# EAGLE design board (EAGLE 7.4.0)
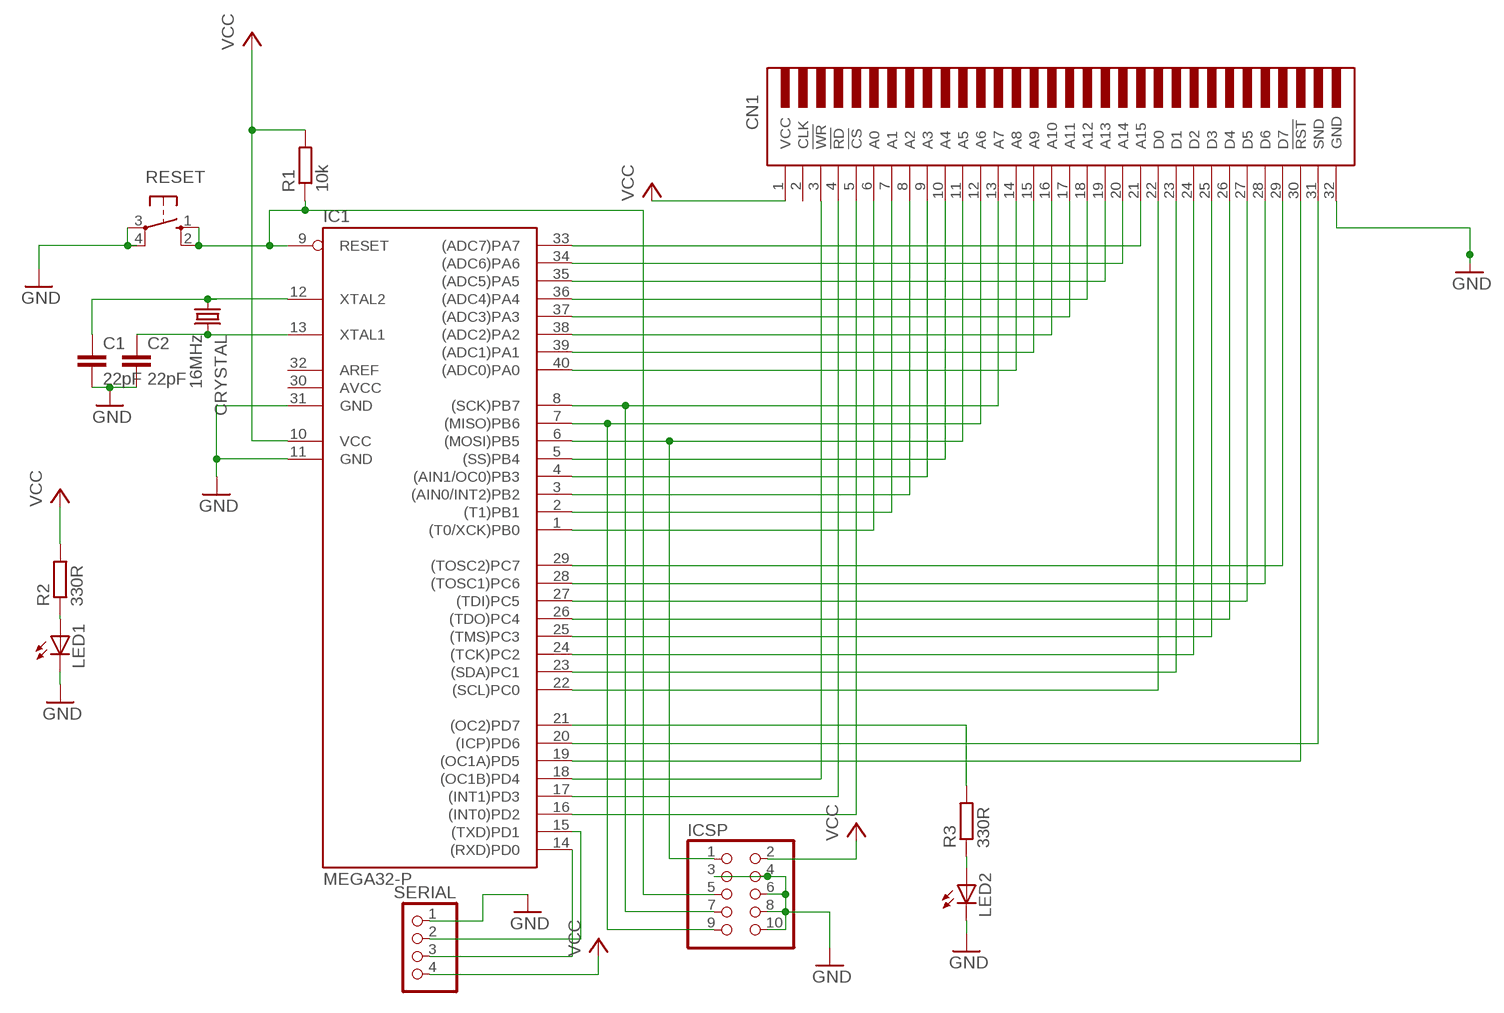
[diagram p0: schematic, sheet 1]

## Parts
C1  22pF  C-EU050-025X075  [C050-025X075]
C2  22pF  C-EU050-025X075  [C050-025X075]
CN1  GBCONN  [GBCONN]
CRYSTAL  16MHz  CRYSTALHC49S  [HC49/S]
IC1  MEGA32-P  [DIL40]
ICSP  PINHD-2X5  [2X05]
LED1  LED3MM  [LED3MM]
LED2  LED3MM  [LED3MM]
R1  10k  R-EU_0204/7  [0204/7]
R2  330R  R-EU_0204/7  [0204/7]
R3  330R  R-EU_0204/7  [0204/7]
RESET  10-XX  [B3F-10XX]
SERIAL  PINHD-1X4/90  [1X04/90]

## Nets
GND: C1.2 C2.2 CN1.32(GND) IC1.11(GND) IC1.31(GND) ICSP.3 ICSP.4 ICSP.6 ICSP.8 ICSP.10 LED1.K(C) LED2.K(C) RESET.3(P) RESET.4(P1) SERIAL.1
N$1: CN1.29(D7) IC1.29((TOSC2)PC7)
N$2: CN1.28(D6) IC1.28((TOSC1)PC6)
N$3: CN1.27(D5) IC1.27((TDI)PC5)
N$4: CN1.26(D4) IC1.26((TDO)PC4)
N$5: CN1.25(D3) IC1.25((TMS)PC3)
N$6: CN1.24(D2) IC1.24((TCK)PC2)
N$7: CN1.23(D1) IC1.23((SDA)PC1)
N$8: CN1.22(D0) IC1.22((SCL)PC0)
N$9: CN1.21(A15) IC1.33((ADC7)PA7)
N$10: CN1.20(A14) IC1.34((ADC6)PA6)
N$11: CN1.19(A13) IC1.35((ADC5)PA5)
N$12: CN1.18(A12) IC1.36((ADC4)PA4)
N$13: CN1.17(A11) IC1.37((ADC3)PA3)
N$14: CN1.16(A10) IC1.38((ADC2)PA2)
N$15: CN1.15(A9) IC1.39((ADC1)PA1)
N$16: CN1.14(A8) IC1.40((ADC0)PA0)
N$17: CN1.13(A7) IC1.8((SCK)PB7) ICSP.7
N$18: CN1.12(A6) IC1.7((MISO)PB6) ICSP.9
N$19: CN1.11(A5) IC1.6((MOSI)PB5) ICSP.1
N$20: CN1.10(A4) IC1.5((SS)PB4)
N$21: CN1.9(A3) IC1.4((AIN1/OC0)PB3)
N$22: CN1.8(A2) IC1.3((AIN0/INT2)PB2)
N$23: CN1.7(A1) IC1.2((T1)PB1)
N$24: CN1.6(A0) IC1.1((T0/XCK)PB0)
N$25: CN1.30(!RST) IC1.19((OC1A)PD5)
N$26: CN1.4(!RD) IC1.17((INT1)PD3)
N$27: CN1.5(!CS) IC1.16((INT0)PD2)
N$28: LED1.A R2.1
N$29: CN1.31(SND) IC1.20((ICP)PD6)
N$30: C1.1 CRYSTAL.1 IC1.12(XTAL2)
N$31: C2.1 CRYSTAL.2 IC1.13(XTAL1)
N$32: CN1.3(!WR) IC1.18((OC1B)PD4)
N$33: LED2.A R3.1
N$34: IC1.21((OC2)PD7) R3.2
N$35: IC1.9(RESET) ICSP.5 R1.1 RESET.1(S) RESET.2(S1)
N$36: IC1.15((TXD)PD1) SERIAL.2
N$37: IC1.14((RXD)PD0) SERIAL.3
VCC: CN1.1(VCC) IC1.10(VCC) ICSP.2 R1.2 R2.2 SERIAL.4
Unconnected: CN1.2(CLK) IC1.32(AREF)

## Power pins joined to a net without a drawn wire
AVCC: IC1.30(AVCC)

## Library data of the parts
C1 C2 = rcl:C-EU: CAPACITOR, European symbol
CN1 = GAMEBOY:GBCONN
CRYSTAL = crystal:CRYSTAL: CRYSTAL; OC_FARNELL: 1667008; OC_NEWARK: unknown
IC1 = atmel:MEGA32-P: MICROCONTROLLER 32 Kbytes FLASH 2 Kbytes SRAM 1 Kbytes EEPROM USART 8-channel 10 bit ADC Source: www.atmel.com .. doc2503.pdf; MPN: ATMEGA32-16PU; OC_FARNELL: 1661729; OC_NEWARK: 51P1794
ICSP = pinhead:PINHD-2X5: PIN HEADER
LED1 LED2 = led:LED: LED OSRAM: - CHIPLED LG R971, LG N971, LY N971, LG Q971, LY Q971, LO R971, LY R971 LH N974, LH R974 LS Q976, LO Q976, LY Q976 LO Q996 - Hyper CHIPLED LW Q18S LB Q993, LB Q99A, LB R99A - SideLED LS A670, LO A670, LY A670, LG A670, LP A670 LB A673, LV A673, LT A673, LW A673 LH A674 LY A675 LS A676, LA A676, LO A676, LY A676, LW A676 LS A679, LY A679, LG A679 - Hyper Micro SIDELED® LS Y876, LA Y876, LO Y876, LY Y876 LT Y87S - SmartLED LW L88C, LW L88S LB L89C, LB L89S, LG L890 LS L89K, LO L89K, LY L89K LS L896, LA L896, LO L896, LY L896 - TOPLED LS T670, LO T670, LY T670, LG T670, LP T670 LSG T670, LSP T670, LSY T670, LOP T670, LYG T670 LG T671, LOG T671, LSG T671 LB T673, LV T673, LT T673, LW T673 LH T674 LS T676, LA T676, LO T676, LY T676, LB T676, LH T676, LSB T676, LW T676 LB T67C, LV T67C, LT T67C, LS T67K, LO T67K, LY T67K, LW E67C LS E67B, LA E67B, LO E67B, LY E67B, LB E67C, LV E67C, LT E67C LW T67C LS T679, LY T679, LG T679 LS T770, LO T770, LY T770, LG T770, LP T770 LB T773, LV T773, LT T773, LW T773 LH T774 LS E675, LA E675, LY E675, LS T675 LS T776, LA T776, LO T776, LY T776, LB T776 LHGB T686 LT T68C, LB T68C - Hyper Mini TOPLED® LB M676 - Mini TOPLED Santana® LG M470 LS M47K, LO M47K, LY M47K Source: http://www.osram.convergy.de LUXEON: - LUMILED® LXK2-PW12-R00, LXK2-PW12-S00, LXK2-PW14-U00, LXK2-PW14-V00 LXK2-PM12-R00, LXK2-PM12-S00, LXK2-PM14-U00 LXK2-PE12-Q00, LXK2-PE12-R00, LXK2-PE12-S00, LXK2-PE14-T00, LXK2-PE14-U00 LXK2-PB12-K00, LXK2-PB12-L00, LXK2-PB12-M00, LXK2-PB14-N00, LXK2-PB14-P00, LXK2-PB14-Q00 LXK2-PR12-L00, LXK2-PR12-M00, LXK2-PR14-Q00, LXK2-PR14-R00 LXK2-PD12-Q00, LXK2-PD12-R00, LXK2-PD12-S00 LXK2-PH12-R00, LXK2-PH12-S00 LXK2-PL12-P00, LXK2-PL12-Q00, LXK2-PL12-R00 Source: www.luxeon.com KINGBRIGHT: KA-3528ASYC Source: www.kingbright.com
R1-R3 = rcl:R-EU_: RESISTOR, European symbol
RESET = switch-omron:10-XX: OMRON SWITCH; MPN: B3F-1000; OC_FARNELL: 176432; OC_NEWARK: 36M3542
SERIAL = pinhead:PINHD-1X4: PIN HEADER

## Board
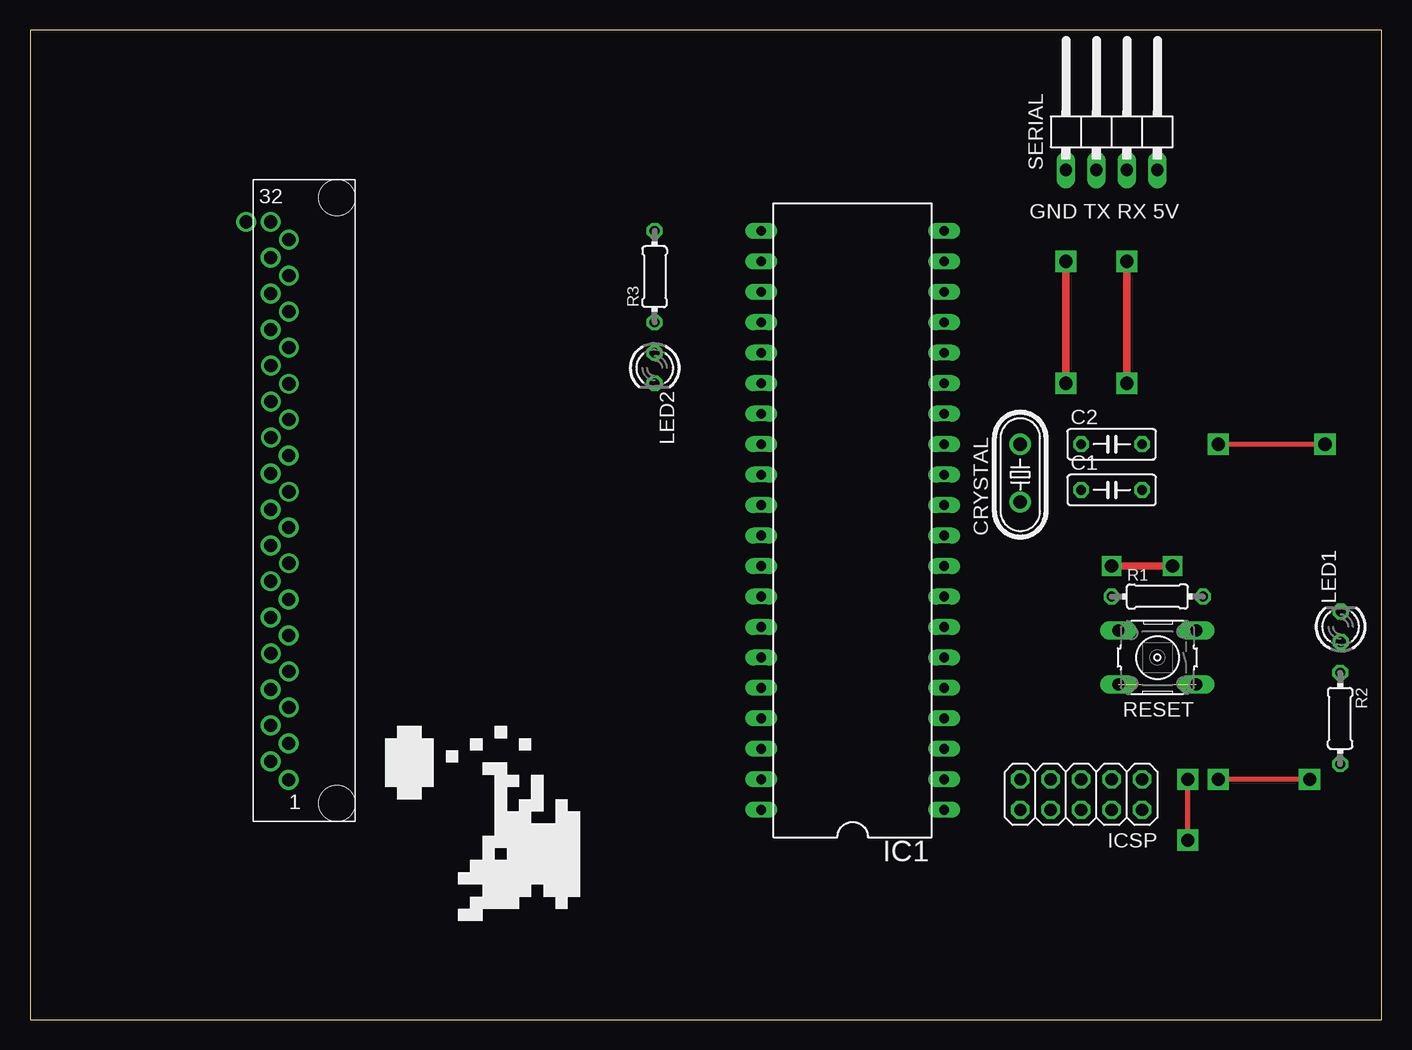
[diagram p1: board, top side]
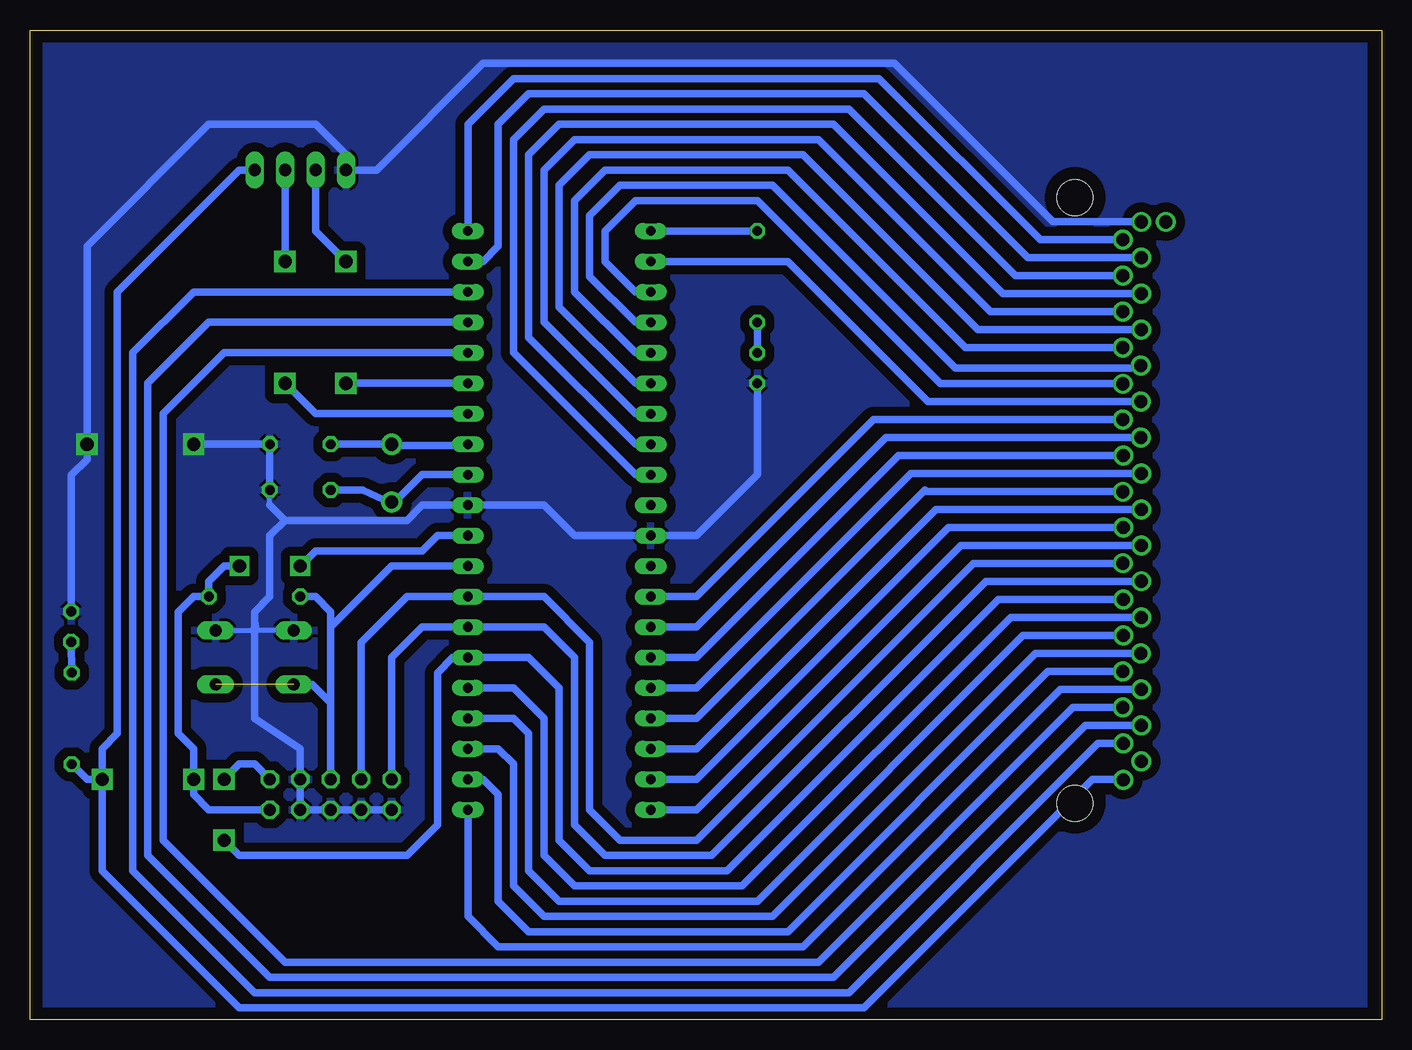
[diagram p2: board, bottom side, seen from below]

Size 112.7 x 82.54 mm. Coordinates in mm from the lower left corner, seen from the top.
Outline: 0,0 112.7,0 112.7,82.54 0,82.54 0,0
Copper layers (1*16): Top 0.035mm / dielectric 1.5mm / Bottom 0.035mm
Design rules "default *": minimum track width 10mil, minimum drill 24mil, track to track 30mil, track to pad 30mil, pad to pad 8mil, via to via 8mil, smd to smd 8mil, copper to edge 40mil, drill to drill 8mil, minimum pad ring 10mil, minimum via ring 8mil, stop-mask expansion 4mil, vias tented up to drill 0mil, thermal gap 10mil

### Footprints (pad centres in the part's own frame; a part is rotated, then mirrored left to right if it is on the bottom)
C050-025X075 = drill 0.813 octagon: 1 -2.54,0; 2 2.54,0
GBCONN = drill 0.813 pad 1.397: 1 0,0; 2 -1.5,1.5; 3 0,3; 4 -1.5,4.5; 5 0,6; 6 -1.5,7.5; 7 0,9; 8 -1.5,10.5; 9 0,12; 10 -1.5,13.5; 11 0,15; 12 -1.5,16.5; 13 0,18; 14 -1.5,19.5; 15 0,21; 16 -1.5,22.5; 17 0,24; 18 -1.5,25.5; 19 0,27; 20 -1.5,28.5; 21 0,30; 22 -1.5,31.5; 23 0,33; 24 -1.5,34.5; 25 0,36; 26 -1.5,37.5; 27 0,39; 28 -1.5,40.5; 29 0,42; 30 -1.5,43.5; 31 0,45; 32 -1.5,46.5 | hole 3: 4,48.5; 4,-2
HC49/S = drill 0.813: 1 -2.413,0; 2 2.413,0
DIL40 = drill 0.813 long: 1 -24.13,-7.62; 2 -21.59,-7.62; 3 -19.05,-7.62; 4 -16.51,-7.62; 5 -13.97,-7.62; 6 -11.43,-7.62; 7 -8.89,-7.62; 8 -6.35,-7.62; 9 -3.81,-7.62; 10 -1.27,-7.62; 11 1.27,-7.62; 12 3.81,-7.62; 13 6.35,-7.62; 14 8.89,-7.62; 15 11.43,-7.62; 16 13.97,-7.62; 17 16.51,-7.62; 18 19.05,-7.62; 19 21.59,-7.62; 20 24.13,-7.62; 21 24.13,7.62; 22 21.59,7.62; 23 19.05,7.62; 24 16.51,7.62; 25 13.97,7.62; 26 11.43,7.62; 27 8.89,7.62; 28 6.35,7.62; 29 3.81,7.62; 30 1.27,7.62; 31 -1.27,7.62; 32 -3.81,7.62; 33 -6.35,7.62; 34 -8.89,7.62; 35 -11.43,7.62; 36 -13.97,7.62; 37 -16.51,7.62; 38 -19.05,7.62; 39 -21.59,7.62; 40 -24.13,7.62
2X05 = drill 1.016 octagon: 1 -5.08,-1.27; 2 -5.08,1.27; 3 -2.54,-1.27; 4 -2.54,1.27; 5 0,-1.27; 6 0,1.27; 7 2.54,-1.27; 8 2.54,1.27; 9 5.08,-1.27; 10 5.08,1.27
LED3MM = drill 0.813 octagon: A -1.27,0; K 1.27,0
0204/7 = drill 0.813 octagon: 1 -3.81,0; 2 3.81,0
B3F-10XX = drill 1.016 long: 1 -3.251,2.261; 2 3.251,2.261; 3 -3.251,-2.261; 4 3.251,-2.261
1X04/90 = drill 1.016 long: 1 -3.81,-3.81; 2 -1.27,-3.81; 3 1.27,-3.81; 4 3.81,-3.81

### Placement (x,y rotation side)
C1  90.17,44.2 0 top
C2  90.17,48.01 0 top
CN1  21.59,20.07 0 top
CRYSTAL  82.55,45.47 90 top
IC1  68.58,41.66 90 top
ICSP  87.63,18.8 180 top
LED1  109.27,32.79 90 top
LED2  52.07,54.36 270 top
R1  93.98,35.31 0 top
R2  109.22,25.15 270 top
R3  52.07,61.98 90 top
RESET  93.98,30.23 180 top
SERIAL  90.17,74.68 0 top

### Tracks (layer width: path | path; a pad name or v marks a point on that pad's centre or on a via)
GND  (via drill 0.6, 0.6 pad 1.27, 0.6 pad 1.78, 1.1 pad 1.27, 1.1 pad 1.68, 1.1 pad 1.78)
  Top 0.406: v99.06,48.01 v107.95,48.01
  Bottom 0.406: 92.71,42.93 C1.2 | 93.7,32.49 93.98,34.04 | RESET.4 93.7,32.49 | 93.7,32.49 93.98,32.77 94.26,32.49 RESET.3
  Bottom 0.61: ICSP.10 ICSP.8 ICSP.6 ICSP.4 ICSP.3 90.17,22.61 93.98,25.15 93.98,32.77 93.98,34.04 92.71,35.31 92.71,40.39 91.44,41.66 | C1.2 C2.2 v99.06,48.01 | 91.44,41.66 81.28,41.66 80.01,42.93 IC1.11 69.85,42.93 67.31,40.39 IC1.31 57.15,40.39 52.07,45.47 LED2.K | 91.44,41.66 92.71,42.93 | CN1.32 27.45,66.57 40.64,79.76 74.93,79.76 83.82,70.87 SERIAL.1 86.36,72.14 88.9,74.68 97.79,74.68 107.95,64.52 v107.95,48.01 107.95,46.74 109.27,45.41 LED1.K
  pour Bottom: 1.52,82.55 112.52,82.55 112.52,0 1.52,0
N$1
  Bottom 0.406: 62.23,45.47 IC1.29
  Bottom 0.61: CN1.29 30.57,62.07 44.45,75.95 69.85,75.95 72.39,73.41 72.39,55.63 62.23,45.47
N$2
  Bottom 0.406: 62.23,48.01 IC1.28
  Bottom 0.61: CN1.28 31.61,60.57 45.72,74.68 68.58,74.68 71.12,72.14 71.12,56.9 62.23,48.01
N$3
  Bottom 0.406: 62.23,50.55 IC1.27
  Bottom 0.61: CN1.27 32.65,59.07 46.99,73.41 67.31,73.41 69.85,70.87 69.85,58.17 62.23,50.55
N$4
  Bottom 0.406: 62.23,53.09 IC1.26
  Bottom 0.61: CN1.26 33.69,57.57 48.26,72.14 66.04,72.14 68.58,69.6 68.58,59.44 62.23,53.09
N$5
  Bottom 0.406: 62.23,55.63 IC1.25
  Bottom 0.61: CN1.25 34.73,56.07 49.53,70.87 64.77,70.87 67.31,68.33 67.31,60.71 62.23,55.63
N$6
  Bottom 0.406: IC1.24 62.23,58.17 | 20.3,54.36 CN1.24
  Bottom 0.61: 62.23,58.17 66.04,61.98 66.04,67.06 63.5,69.6 50.8,69.6 35.56,54.36 20.3,54.36
N$7
  Bottom 0.406: 62.23,60.71 IC1.23
  Bottom 0.61: CN1.23 36.81,53.07 52.07,68.33 62.23,68.33 64.77,65.79 64.77,63.25 62.23,60.71
N$8
  Bottom 0.61: IC1.22 49.53,63.25 37.85,51.57 CN1.22
N$9
  Bottom 0.61: CN1.21 42.39,50.07 57.15,35.31 IC1.33
N$10
  Bottom 0.61: CN1.20 41.35,48.57 57.15,32.77 IC1.34
N$11
  Bottom 0.61: CN1.19 40.31,47.07 57.15,30.23 IC1.35
N$12
  Bottom 0.61: CN1.18 39.27,45.57 57.15,27.69 IC1.36
N$13
  Bottom 0.406: 37.97,44.07 38.1,44.2
  Bottom 0.61: CN1.17 37.97,44.07 | 38.1,44.2 57.15,25.15 IC1.37
N$14
  Bottom 0.61: CN1.16 37.19,42.57 57.15,22.61 IC1.38
N$15
  Bottom 0.61: CN1.15 36.15,41.07 57.15,20.07 IC1.39
N$16
  Bottom 0.61: CN1.14 35.11,39.57 57.15,17.53 IC1.40
N$17
  Bottom 0.61: CN1.13 34.07,38.07 57.15,14.99 63.5,14.99 66.04,17.53 66.04,31.5 69.85,35.31 IC1.8 81.28,35.31 85.09,31.5 ICSP.7
N$18
  Bottom 0.406: 33.01,36.57 33.02,36.58
  Bottom 0.61: CN1.12 33.01,36.57 | 33.02,36.58 55.88,13.72 64.77,13.72 67.31,16.26 67.31,30.23 69.85,32.77 IC1.7 80.01,32.77 82.55,30.23 ICSP.9
N$19  (via drill 0.6, 1.1 pad 1.78)
  Top 0.406: v96.52,14.99 v96.52,20.07
  Bottom 0.61: CN1.11 31.99,35.07 54.61,12.45 66.04,12.45 68.58,14.99 68.58,27.69 71.12,30.23 IC1.6 77.47,30.23 78.74,28.96 78.74,16.26 81.28,13.72 95.25,13.72 v96.52,14.99 | v96.52,20.07 95.25,21.34 93.98,21.34 ICSP.1
N$20
  Bottom 0.61: CN1.10 30.95,33.57 53.34,11.18 67.31,11.18 69.85,13.72 69.85,25.15 72.39,27.69 IC1.5
N$21
  Bottom 0.61: CN1.9 29.91,32.07 52.07,9.91 68.58,9.91 71.12,12.45 71.12,23.88 72.39,25.15 IC1.4
N$22
  Bottom 0.61: CN1.8 28.87,30.57 50.8,8.64 69.85,8.64 72.39,11.18 72.39,21.34 73.66,22.61 IC1.3
N$23
  Bottom 0.61: CN1.7 27.83,29.07 49.53,7.37 71.12,7.37 73.66,9.91 73.66,18.8 74.93,20.07 IC1.2
N$24
  Bottom 0.61: CN1.6 26.79,27.57 48.26,6.1 73.66,6.1 76.2,8.64 IC1.1
N$25
  Bottom 0.406: 74.93,63.25 IC1.19
  Bottom 0.61: CN1.30 29.53,63.57 43.18,77.22 71.12,77.22 73.66,74.68 73.66,64.52 74.93,63.25
N$26
  Bottom 0.61: CN1.4 24.71,24.57 45.72,3.56 92.71,3.56 102.87,13.72 102.87,53.09 97.79,58.17 IC1.17
N$27
  Bottom 0.61: CN1.5 25.75,26.07 46.99,4.83 91.44,4.83 101.6,14.99 101.6,50.55 96.52,55.63 IC1.16
N$28
  Bottom 0.61: R2.1 LED1.A
N$29
  Bottom 0.61: CN1.31 28.49,65.07 41.91,78.49 72.39,78.49 76.2,74.68 IC1.20
N$30
  Bottom 0.406: 82.55,42.93 84.96,44.2
  Bottom 0.61: IC1.12 80.01,45.47 82.55,42.93 | CRYSTAL.1 84.96,44.2 C1.1
N$31
  Bottom 0.406: 76.33,47.88 IC1.13 | 82.68,48.01 CRYSTAL.2
  Bottom 0.61: CRYSTAL.2 76.33,47.88 | C2.1 82.68,48.01
N$32
  Bottom 0.61: CN1.3 23.67,23.07 44.45,2.29 93.98,2.29 104.14,12.45 104.14,55.63 99.06,60.71 IC1.18
N$33
  Bottom 0.61: R3.1 LED2.A
N$34
  Bottom 0.61: R3.2 IC1.21
N$35  (1 unrouted)
  Bottom 0.61: IC1.9 82.55,37.85 87.63,32.77 | 87.63,32.77 87.63,26.42 | 87.63,26.42 ICSP.5 | 87.63,32.77 87.63,34.04 88.9,35.31 R1.1 | RESET.2 89.18,27.96 87.63,26.42
N$36  (via drill 0.6, 0.6 pad 1.78, 1.1 pad 1.78)
  Top 0.61: v86.36,53.09 v86.36,63.25
  Bottom 0.61: IC1.15 v86.36,53.09 | v86.36,63.25 88.9,65.79 SERIAL.2
N$37  (via drill 0.6, 0.6 pad 1.78, 1.1 pad 1.78)
  Top 0.61: v91.44,53.09 v91.44,63.25
  Bottom 0.61: IC1.14 88.9,50.55 v91.44,53.09 | v91.44,63.25 SERIAL.3
N$38  (via drill 1 pad 1.27)
  other vias: 18.03,66.55
N$39  (via drill 1.1 pad 1.78)
  other vias: 82.55,48.01
N$40  (via drill 1.1 pad 1.78)
  other vias: 82.55,43.18
N$41  (via drill 1.1 pad 1.02)
  other vias: 20.07,66.55
N$42  (via drill 1.1 pad 1.02)
  other vias: 21.59,65.05
N$43  (via drill 1.1 pad 1.02)
  other vias: 20.07,63.55
N$44  (via drill 1.1 pad 1.02)
  other vias: 21.59,62.05
N$45  (via drill 1.1 pad 1.02)
  other vias: 20.07,60.55
N$46  (via drill 1.1 pad 1.02)
  other vias: 21.59,59.05
N$47  (via drill 1.1 pad 1.02)
  other vias: 20.07,57.56
N$48  (via drill 1.1 pad 1.02)
  other vias: 21.59,56.06
N$49  (via drill 1.1 pad 1.02)
  other vias: 20.09,54.56
N$50  (via drill 1.1 pad 1.02)
  other vias: 21.59,53.04
N$51  (via drill 1.1 pad 1.02)
  other vias: 20.09,51.56
N$52  (via drill 1.1 pad 1.02)
  other vias: 21.59,50.06
N$53  (via drill 1.1 pad 1.02)
  other vias: 20.09,48.56
N$54  (via drill 1.1 pad 1.02)
  other vias: 21.56,47.07
N$55  (via drill 1.1 pad 1.02)
  other vias: 20.07,45.57
N$56  (via drill 1.1 pad 1.02)
  other vias: 21.59,44.04
N$57  (via drill 1.1 pad 1.02)
  other vias: 20.07,42.57
N$58  (via drill 1.1 pad 1.02)
  other vias: 21.56,41.07
N$59  (via drill 1.1 pad 1.02)
  other vias: 20.07,39.57
N$60  (via drill 1.1 pad 1.02)
  other vias: 21.59,38.07
N$61  (via drill 1.1 pad 1.02)
  other vias: 20.07,36.58
N$62  (via drill 1.1 pad 1.02)
  other vias: 21.56,35.05
N$63  (via drill 1.1 pad 1.02)
  other vias: 20.07,33.55
N$64  (via drill 1.1 pad 1.02)
  other vias: 21.56,32.05
N$65  (via drill 1.1 pad 1.02)
  other vias: 20.09,30.56
N$66  (via drill 1.1 pad 1.02)
  other vias: 21.59,29.06
N$67  (via drill 1.1 pad 1.02)
  other vias: 20.07,27.56
N$68  (via drill 1.1 pad 1.02)
  other vias: 21.59,26.06
N$69  (via drill 1.1 pad 1.02)
  other vias: 20.07,24.56
N$70  (via drill 1.1 pad 1.02)
  other vias: 21.56,23.06
N$71  (via drill 1.1 pad 1.02)
  other vias: 20.07,21.56
N$72  (via drill 1.1 pad 1.02)
  other vias: 21.56,20.02
N$73  (via drill 1.1 pad 1.02)
  other vias: 18.01,66.55
VCC  (via drill 0.6, 1.1 pad 1.27, 1.1 pad 1.78)
  Top 0.406: v106.68,20.07 v99.06,20.07
  Top 0.61: v90.17,37.85 v95.25,37.85
  Bottom 0.61: IC1.10 78.74,40.39 80.01,39.12 88.9,39.12 v90.17,37.85 | v95.25,37.85 96.52,37.85 97.79,36.58 R1.2 99.06,35.31 100.33,34.04 100.33,23.88 99.06,22.61 v99.06,20.07 99.06,18.8 97.79,17.53 ICSP.2 | CN1.1 24.13,20.07 43.18,1.02 95.25,1.02 106.68,12.45 v106.68,20.07 | SERIAL.4 95.25,70.87 105.41,60.71 105.41,23.88 106.68,22.61 v106.68,20.07 | R2.2 107.95,20.07 v106.68,20.07

### Text on the board
tNames: GND TX RX 5V
tValues: ON LED | Gameboy Cart Tool | Robson Couto | www.dragaosemchama.com.br | Insert cartridge here